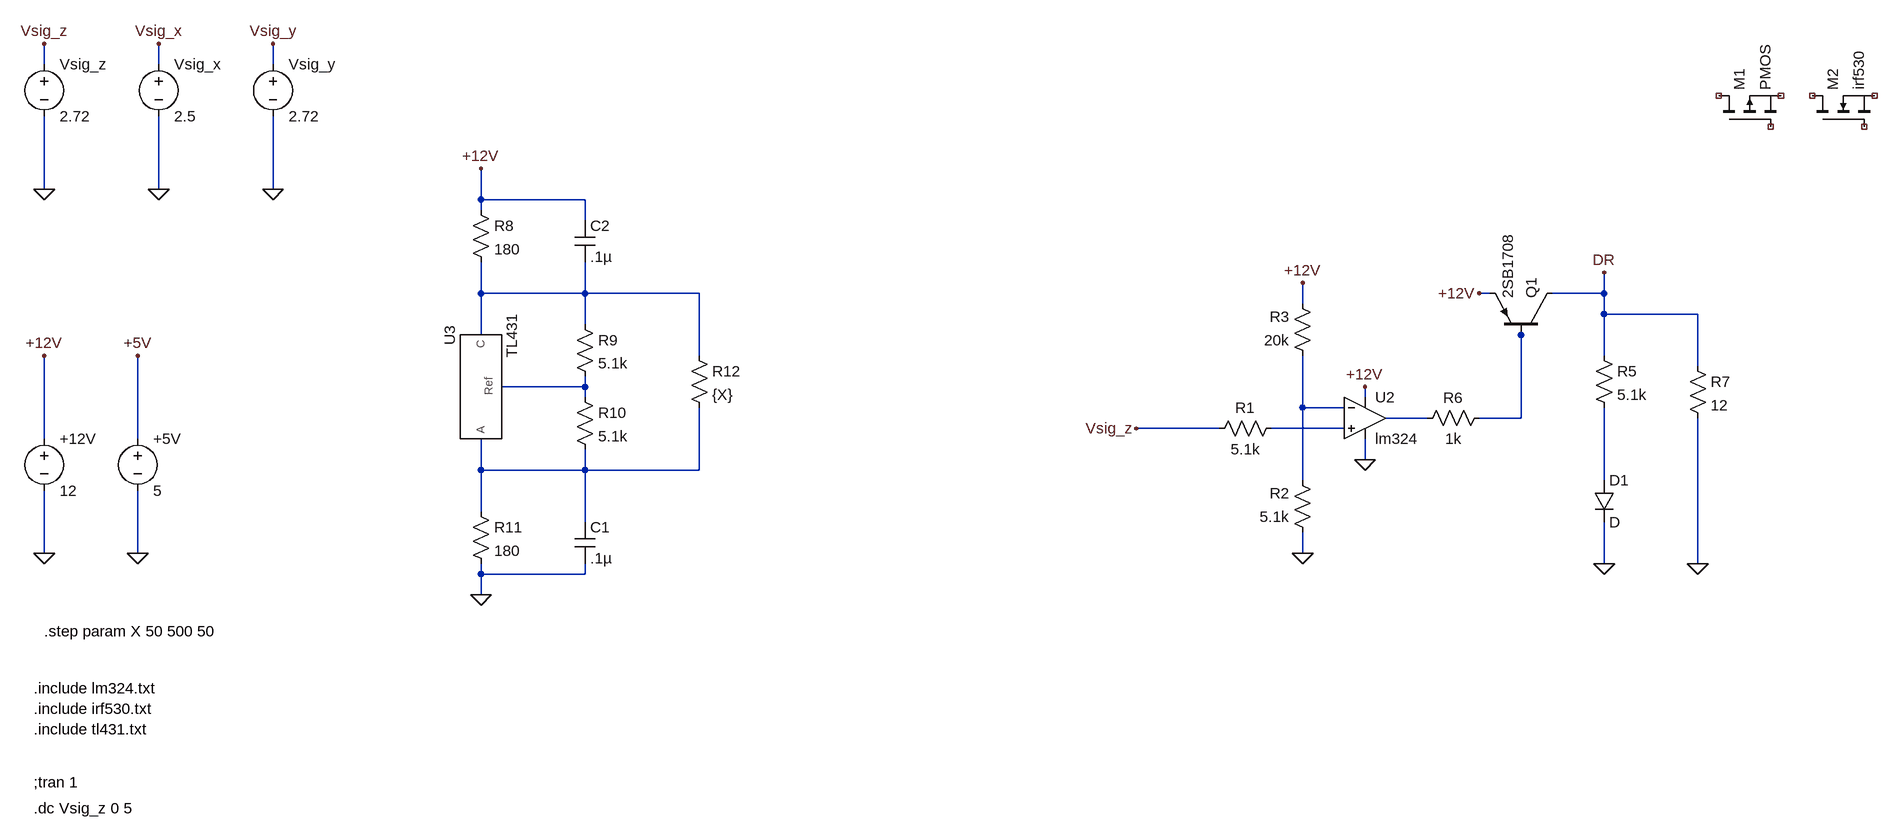
[diagram p0: schematic MagLev_01.asc]
MagLev_01.asc, the LTspice schematic file:
Version 4
SHEET 1 1432 1000
WIRE -1536 -160 -1536 -192
WIRE -1360 -160 -1360 -192
WIRE -1184 -160 -1184 -192
WIRE -1536 32 -1536 -80
WIRE -1360 32 -1360 -80
WIRE -1184 32 -1184 -80
WIRE -864 48 -864 0
WIRE -704 48 -864 48
WIRE -864 64 -864 48
WIRE -704 80 -704 48
WIRE -864 192 -864 144
WIRE -704 192 -704 144
WIRE -704 192 -864 192
WIRE -528 192 -704 192
WIRE 688 192 672 192
WIRE 864 192 864 160
WIRE 864 192 784 192
WIRE 400 208 400 176
WIRE 864 224 864 192
WIRE 1008 224 864 224
WIRE -704 240 -704 192
WIRE -864 256 -864 192
WIRE 736 256 736 240
WIRE -528 288 -528 192
WIRE 864 288 864 224
WIRE 1008 304 1008 224
WIRE -704 336 -704 320
WIRE -704 336 -832 336
WIRE -704 352 -704 336
WIRE 496 352 496 336
WIRE 400 368 400 288
WIRE 464 368 400 368
WIRE 592 384 528 384
WIRE 736 384 736 256
WIRE 736 384 672 384
WIRE 272 400 144 400
WIRE 464 400 352 400
WIRE -1536 416 -1536 288
WIRE -1392 416 -1392 288
WIRE 496 448 496 416
WIRE -864 464 -864 416
WIRE -704 464 -704 432
WIRE -704 464 -864 464
WIRE -528 464 -528 368
WIRE -528 464 -704 464
WIRE 400 480 400 368
WIRE 864 480 864 368
WIRE -864 528 -864 464
WIRE -704 544 -704 464
WIRE -1536 592 -1536 496
WIRE -1392 592 -1392 496
WIRE 400 592 400 560
WIRE 864 608 864 544
WIRE 1008 608 1008 384
WIRE -864 624 -864 608
WIRE -704 624 -704 608
WIRE -704 624 -864 624
WIRE -864 656 -864 624
FLAG -1392 592 0
FLAG -1536 288 +12V
FLAG -1536 592 0
FLAG -1392 288 +5V
FLAG -1536 32 0
FLAG 496 336 +12V
FLAG 496 448 0
FLAG 672 192 +12V
FLAG 864 608 0
FLAG 864 160 DR
FLAG -1536 -192 Vsig_z
FLAG 144 400 Vsig_z
FLAG -1360 32 0
FLAG -1184 32 0
FLAG -1360 -192 Vsig_x
FLAG -1184 -192 Vsig_y
FLAG 1008 608 0
FLAG -864 656 0
FLAG -864 0 +12V
FLAG 400 176 +12V
FLAG 400 592 0
SYMBOL voltage -1392 400 R0
WINDOW 123 0 0 Left 0
WINDOW 39 0 0 Left 0
SYMATTR InstName +5V
SYMATTR Value 5
SYMBOL voltage -1536 400 R0
WINDOW 123 0 0 Left 0
WINDOW 39 0 0 Left 0
SYMATTR InstName +12V
SYMATTR Value 12
SYMBOL voltage -1536 -176 R0
WINDOW 123 0 0 Left 0
WINDOW 39 0 0 Left 0
SYMATTR InstName Vsig_z
SYMATTR Value 2.72
SYMBOL OpAmps\\opamp2 496 320 R0
SYMATTR InstName U2
SYMATTR Value lm324
SYMBOL res 848 272 R0
SYMATTR InstName R5
SYMATTR Value 5.1k
SYMBOL diode 848 480 R0
SYMATTR InstName D1
SYMBOL voltage -1360 -176 R0
WINDOW 123 0 0 Left 0
WINDOW 39 0 0 Left 0
SYMATTR InstName Vsig_x
SYMATTR Value 2.5
SYMBOL voltage -1184 -176 R0
WINDOW 123 0 0 Left 0
WINDOW 39 0 0 Left 0
SYMATTR InstName Vsig_y
SYMATTR Value 2.72
SYMBOL nmos 1184 -64 R270
SYMATTR InstName M2
SYMATTR Value irf530
SYMATTR Prefix X
SYMBOL pmos 1040 -64 R270
SYMATTR InstName M1
SYMBOL pnp 784 256 M270
SYMATTR InstName Q1
SYMATTR Value 2SB1708
SYMBOL res 688 368 R90
WINDOW 0 0 56 VBottom 2
WINDOW 3 32 56 VTop 2
SYMATTR InstName R6
SYMATTR Value 1k
SYMBOL res 992 288 R0
SYMATTR InstName R7
SYMATTR Value 12
SYMBOL AutoGenerated\\TL431 -864 384 R270
SYMATTR InstName U3
SYMBOL res -880 48 R0
SYMATTR InstName R8
SYMATTR Value 180
SYMBOL res -720 224 R0
SYMATTR InstName R9
SYMATTR Value 5.1k
SYMBOL res -720 336 R0
SYMATTR InstName R10
SYMATTR Value 5.1k
SYMBOL res -880 512 R0
SYMATTR InstName R11
SYMATTR Value 180
SYMBOL cap -720 544 R0
SYMATTR InstName C1
SYMATTR Value .1µ
SYMBOL cap -720 80 R0
SYMATTR InstName C2
SYMATTR Value .1µ
SYMBOL res -544 272 R0
SYMATTR InstName R12
SYMATTR Value {X}
SYMBOL res 368 384 R90
WINDOW 0 0 56 VBottom 2
WINDOW 3 32 56 VTop 2
SYMATTR InstName R1
SYMATTR Value 5.1k
SYMBOL res 416 576 R180
WINDOW 0 36 76 Left 2
WINDOW 3 36 40 Left 2
SYMATTR InstName R2
SYMATTR Value 5.1k
SYMBOL res 416 304 R180
WINDOW 0 36 76 Left 2
WINDOW 3 36 40 Left 2
SYMATTR InstName R3
SYMATTR Value 20k
TEXT -1552 800 Left 2 !.include lm324.txt\n.include irf530.txt\n.include tl431.txt
TEXT -1552 944 Left 2 !;tran 1
TEXT -1552 984 Left 2 !.dc Vsig_z 0 5
TEXT -1536 712 Left 2 !.step param X 50 500 50

The netlist it stands for:
* MagLev_01.asc
V§+5V +5V 0 5
V§+12V +12V 0 12
Vsig_z Vsig_z 0 2.72
XU2 N006 N004 +12V 0 N005 lm324  ; pins In+ In- V+ V- OUT
R5 DR N008 5.1k
D1 N008 0 D
Vsig_x Vsig_x 0 2.5
Vsig_y Vsig_y 0 2.72
XM2 NC_01 NC_02 NC_03 irf530  ; pins D G S
M1 NC_04 NC_05 NC_06 NC_06 PMOS
Q1 DR N002 +12V 0 2SB1708
R6 N002 N005 1k
R7 DR 0 12
XU3 N003 N007 N001 TL431  ; pins Ref A C
R8 +12V N001 180
R9 N001 N003 5.1k
R10 N003 N007 5.1k
R11 N007 0 180
C1 N007 0 .1µ
C2 +12V N001 .1µ
R12 N001 N007 {X}
R1 N006 Vsig_z 5.1k
R2 0 N004 5.1k
R3 N004 +12V 20k
.model D D
.lib standard.dio
.model NPN NPN
.model PNP PNP
.lib standard.bjt
.model NMOS NMOS
.model PMOS PMOS
.lib standard.mos
.include lm324.txt
.include irf530.txt
.include tl431.txt
;tran 1
.dc Vsig_z 0 5
.step param X 50 500 50
.lib C:\Users\kevin.dueck\Documents\Personal\Projects\MagLev\LtSpice\tl431.txt
.backanno
.end